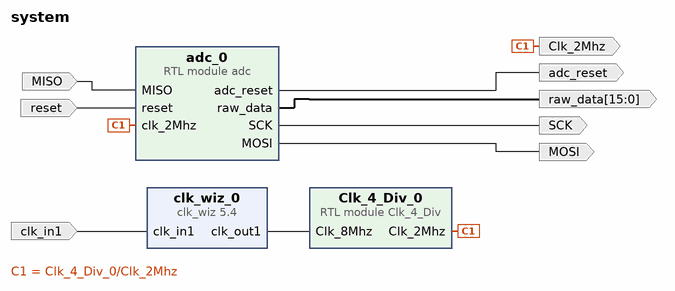
[diagram p0: block diagram of the top level]
# Vivado block design system, xc7z010clg400-1, Vivado 2017.2
create_bd_design system

create_bd_port -dir O SCK
create_bd_port -dir O -from 15 -to 0 raw_data
create_bd_port -dir O -type rst adc_reset
create_bd_port -dir O MOSI
create_bd_port -dir I MISO
create_bd_port -dir I -type rst reset
create_bd_port -dir I -type clk clk_in1
set_property -dict {CONFIG.FREQ_HZ 50000000} [get_bd_ports clk_in1]
create_bd_port -dir O Clk_2Mhz

create_bd_cell -type module -reference adc adc_0
create_bd_cell -type ip -vlnv xilinx.com:ip:clk_wiz:5.4 clk_wiz_0
set_property -dict [list \
  CONFIG.PRIM_IN_FREQ 50.000 \
  CONFIG.CLKIN1_JITTER_PS 200.0 \
  CONFIG.CLKOUT1_REQUESTED_OUT_FREQ 8.000 \
  CONFIG.USE_LOCKED false \
  CONFIG.USE_RESET false \
  CONFIG.MMCM_DIVCLK_DIVIDE 1 \
  CONFIG.MMCM_CLKFBOUT_MULT_F 17.500 \
  CONFIG.MMCM_CLKIN1_PERIOD 20.000 \
  CONFIG.MMCM_CLKIN2_PERIOD 10.0 \
  CONFIG.MMCM_CLKOUT0_DIVIDE_F 109.375 \
  CONFIG.CLKOUT1_JITTER 308.663 \
  CONFIG.CLKOUT1_PHASE_ERROR 151.172 \
] [get_bd_cells clk_wiz_0]
create_bd_cell -type module -reference Clk_4_Div Clk_4_Div_0

# ---- connections ----

connect_bd_net [get_bd_pins adc_0/SCK] [get_bd_ports SCK]
connect_bd_net [get_bd_pins adc_0/raw_data] [get_bd_ports raw_data]
connect_bd_net [get_bd_pins adc_0/adc_reset] [get_bd_ports adc_reset]
connect_bd_net [get_bd_pins adc_0/MOSI] [get_bd_ports MOSI]
connect_bd_net [get_bd_ports MISO] [get_bd_pins adc_0/MISO]
connect_bd_net [get_bd_ports reset] [get_bd_pins adc_0/reset]
connect_bd_net [get_bd_pins clk_wiz_0/clk_out1] [get_bd_pins Clk_4_Div_0/Clk_8Mhz]
connect_bd_net -net clk_in1_1 [get_bd_ports clk_in1] [get_bd_pins clk_wiz_0/clk_in1]
connect_bd_net [get_bd_pins Clk_4_Div_0/Clk_2Mhz] [get_bd_ports Clk_2Mhz] [get_bd_pins adc_0/clk_2Mhz]

validate_bd_design
save_bd_design
